# EAGLE board ArmazCape - Rev B2 (EAGLE 7.5.0)
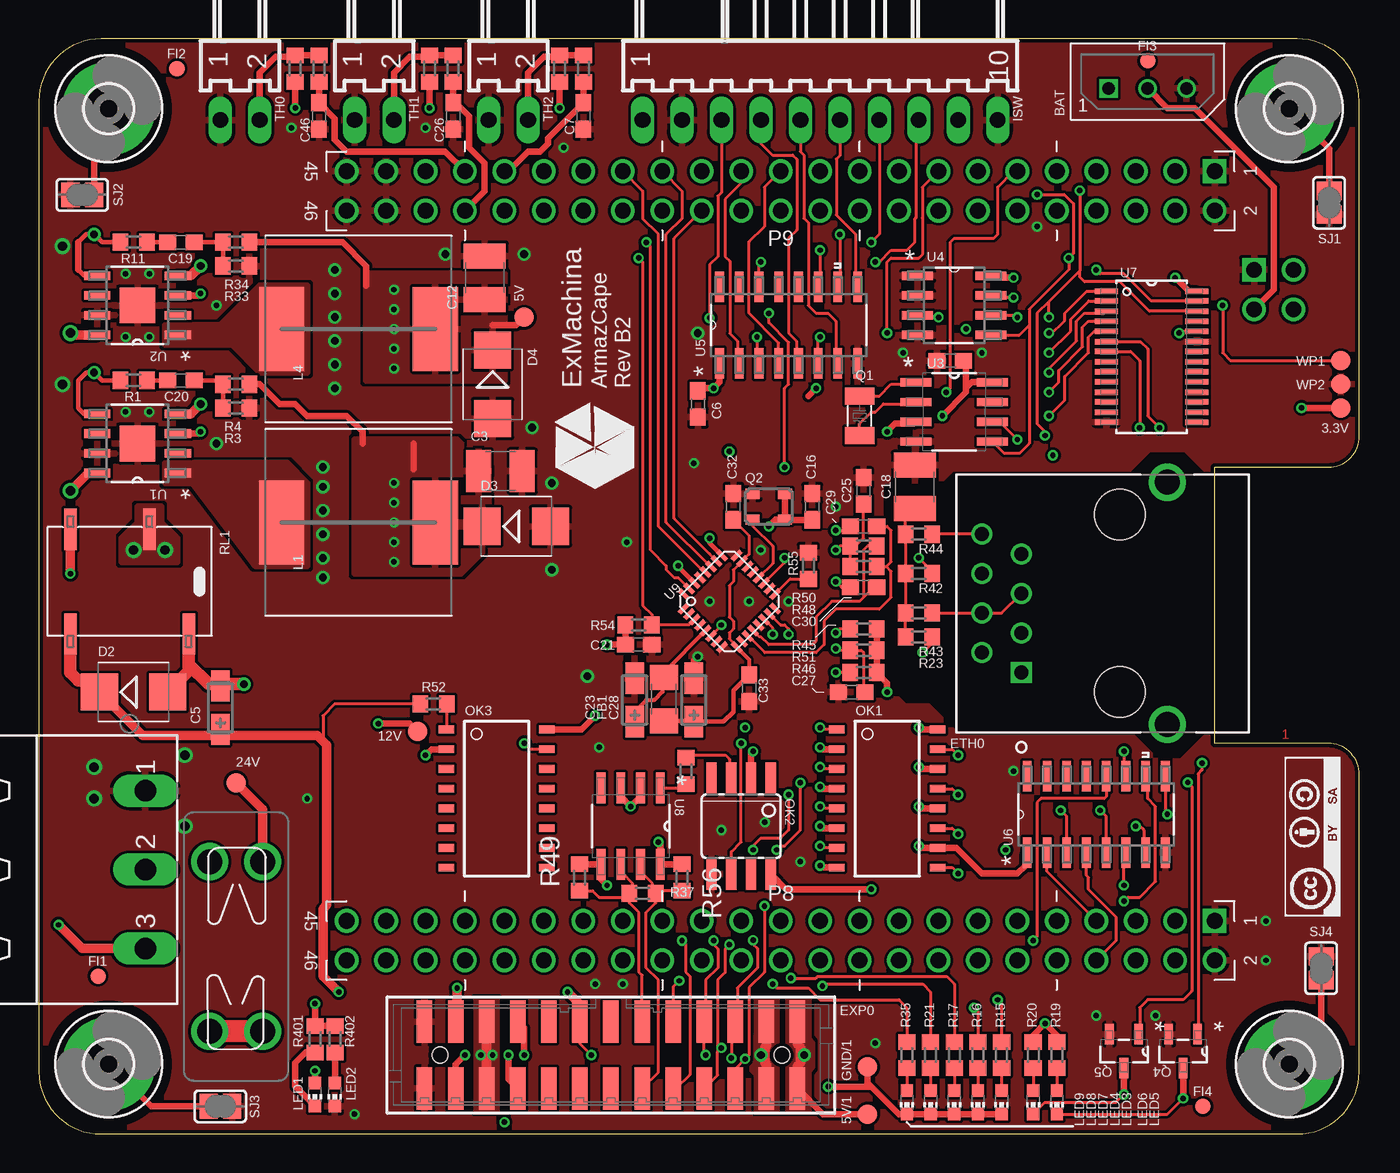
[diagram p3: board, top side]
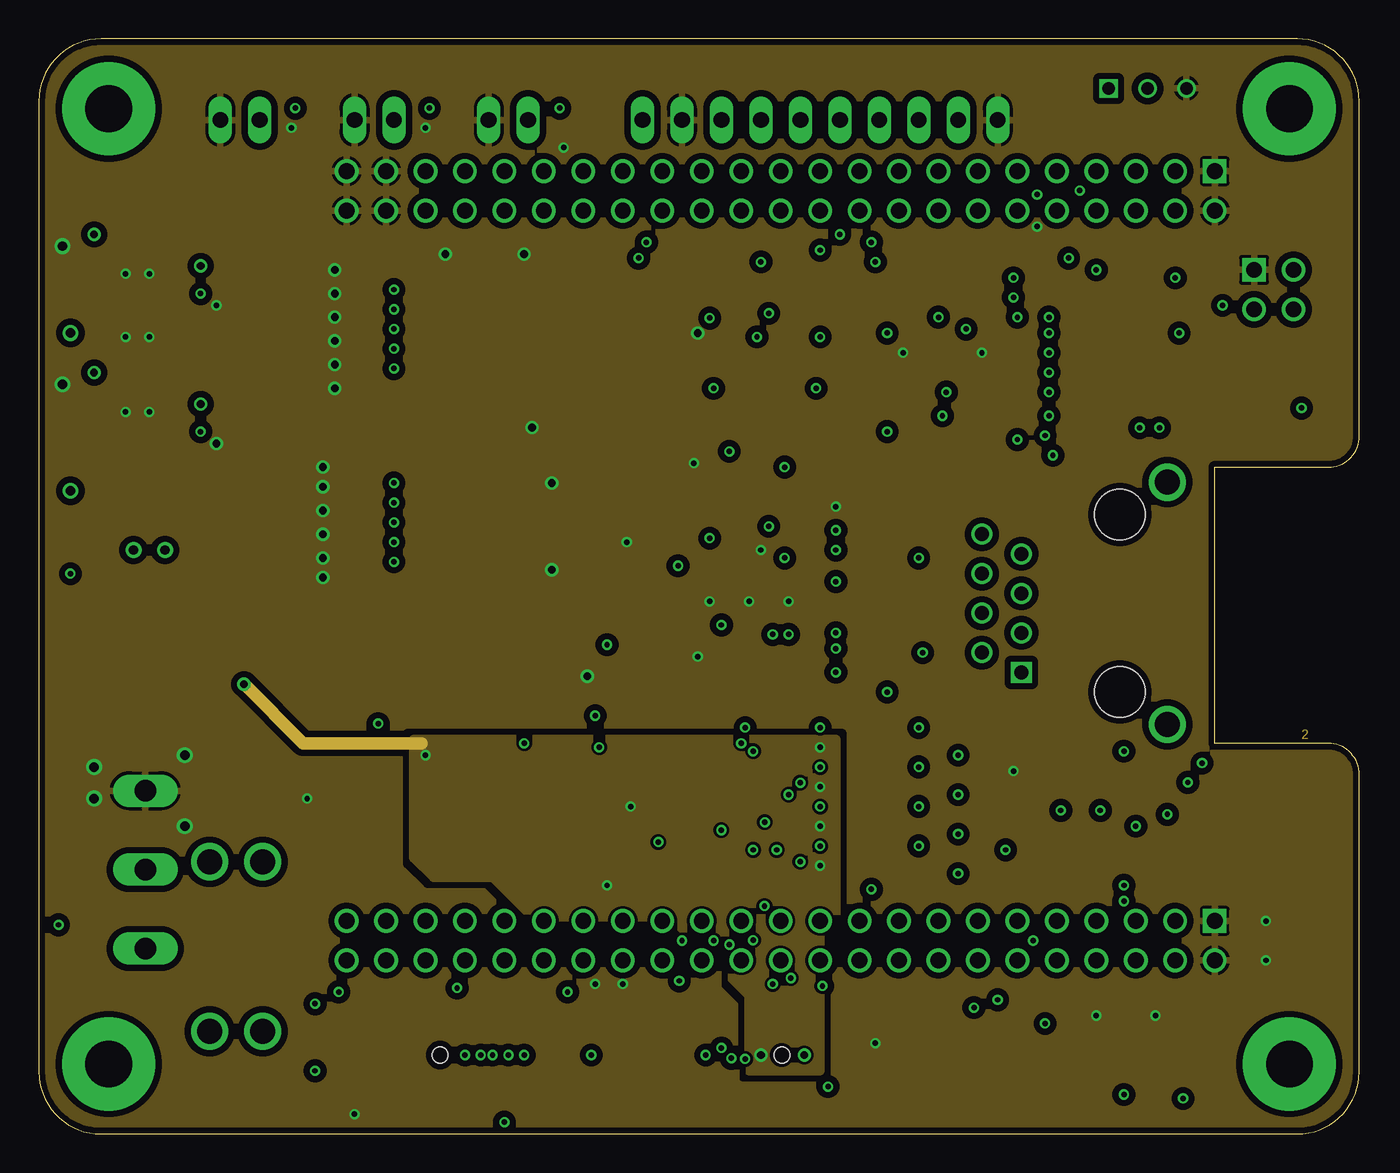
[diagram p4: board, inner layer Route2]
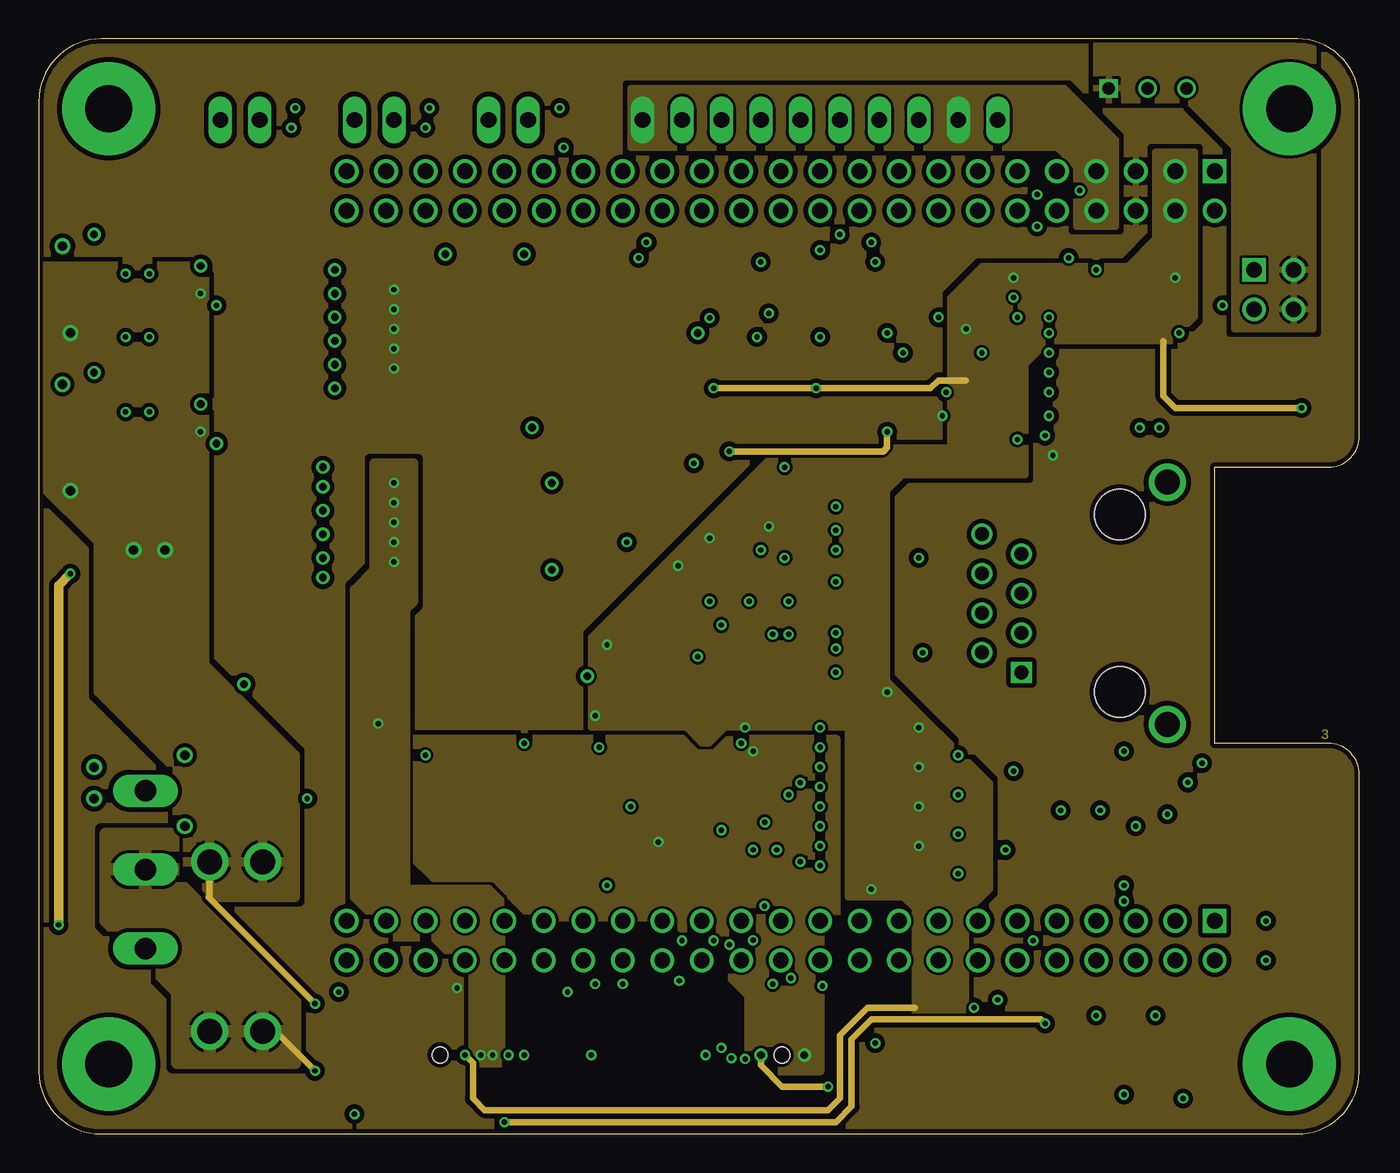
[diagram p5: board, inner layer Route15]
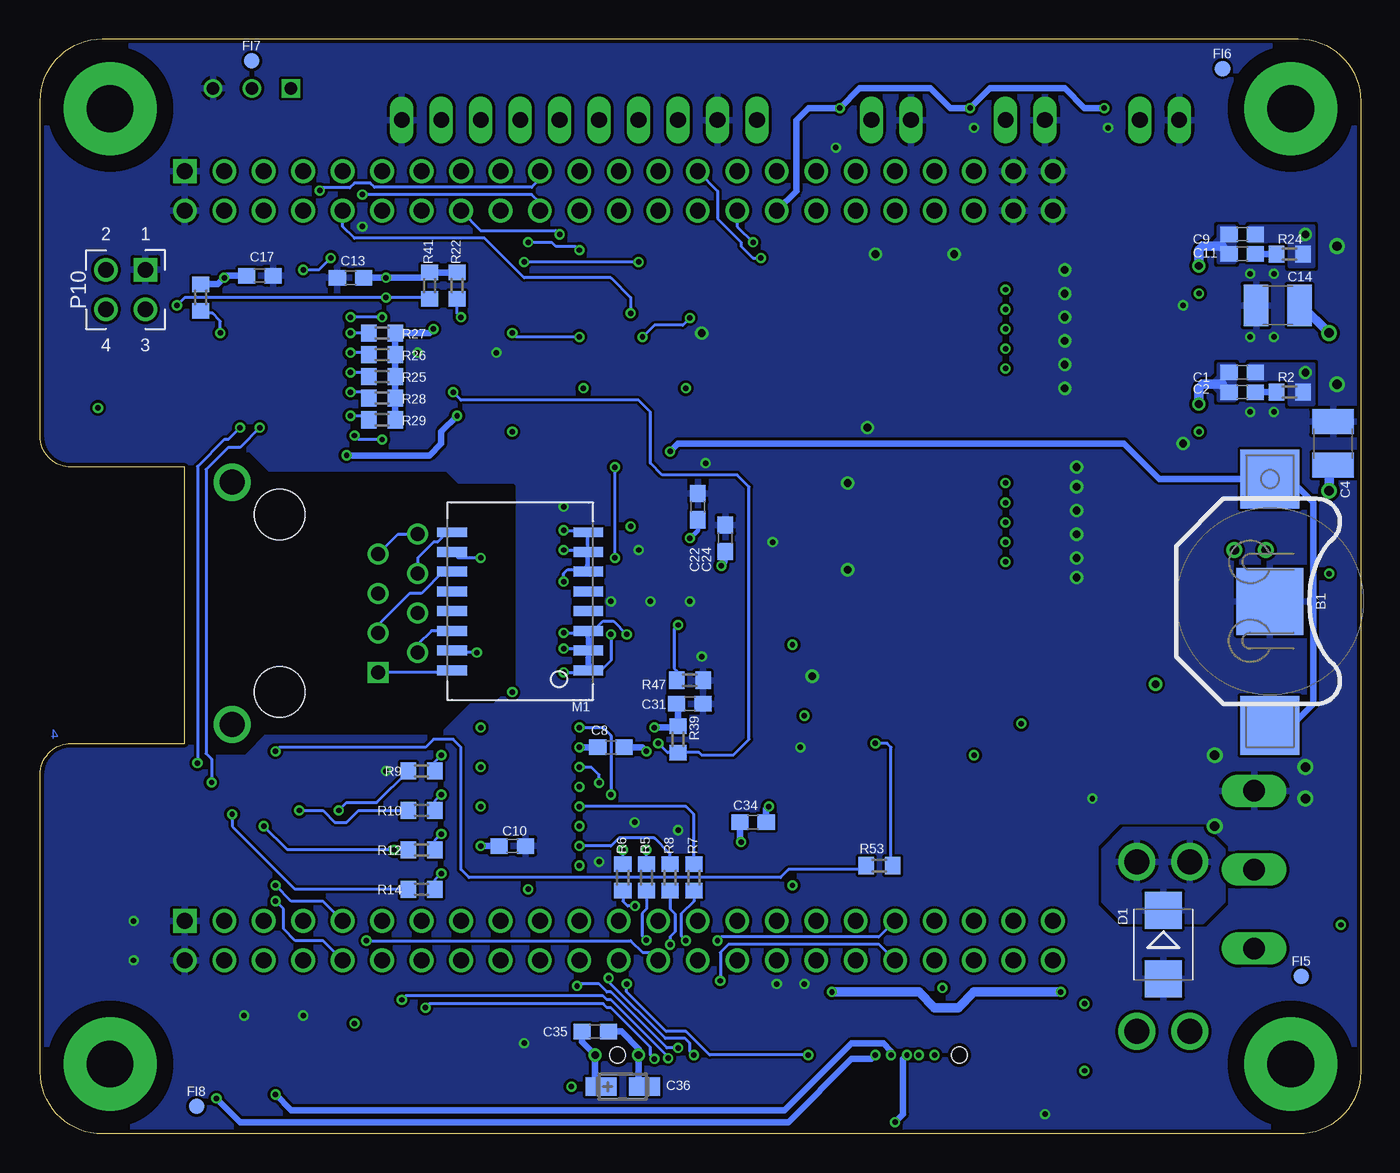
[diagram p6: board, bottom side, seen from below]

Size 85 x 70.5 mm. Coordinates in mm from the lower left corner, seen from the top.
Outline: 75.69,42.93 83,42.93 arc90 85,44.93 85,66.5 arc90 81,70.5 4,70.5 arc90 0,66.5 0,4 arc90 4,0 81,0 arc90 85,4 85,23.15 arc90 83,25.15 75.69,25.15 75.69,42.93
Copper layers (1+2*15+16): Top 0.018mm / dielectric 0.36mm / Route2 0.035mm / dielectric 0.71mm / Route15 0.035mm / dielectric 0.36mm / Bottom 0.018mm
Design rules "eC_4Layer_PClass5_BaseCopperO18-I35 *": minimum track width 0.175mm, minimum drill 0.35mm, track to track 0.175mm, track to pad 0.175mm, pad to pad 0.175mm, via to via 0.175mm, smd to smd 0mil, copper to edge 0.25mm, drill to drill 0.35mm, minimum pad ring 0.2mm, minimum via ring 0.15mm, stop-mask expansion 0mil, vias tented up to drill 0.45mm, thermal gap 0.2mm
Net classes: 0 default: width 0.178 mm, drill 0.25 mm, clearance 0.102 mm; 1 supply: width 0.406 mm, drill 0.35 mm, clearance 0.203 mm to class 0, clearance 0.02 mm

## Footprints (pad centres in the part's own frame; a part is rotated, then mirrored left to right if it is on the bottom)
B1,27 = smd 1.27 x 1.27: TP 0,0
3000 = smd 3.81 x 3.81: +1 -7.874,0; +2 8.001,0 | smd 4.318 x 4.318: - 0,0
5267-02A = drill 0.8 square: P1 -2.5,0 | drill 0.8: P2 0,0; P3 2.5,0
BBB = drill 1.016 square: P8.1 -27.94,46.99; P9.1 -27.94,-1.27; P10.1 -30.48,5.08 | drill 1.016: P8.2 -27.94,49.53; P8.3 -25.4,46.99; P8.4 -25.4,49.53; P8.5 -22.86,46.99; P8.6 -22.86,49.53; P8.7 -20.32,46.99; P8.8 -20.32,49.53; P8.9 -17.78,46.99; P8.10 -17.78,49.53; P8.11 -15.24,46.99; P8.12 -15.24,49.53; P8.13 -12.7,46.99; P8.14 -12.7,49.53; P8.15 -10.16,46.99; P8.16 -10.16,49.53; P8.17 -7.62,46.99; P8.18 -7.62,49.53; P8.19 -5.08,46.99; P8.20 -5.08,49.53; P8.21 -2.54,46.99; P8.22 -2.54,49.53; P8.23 0,46.99; P8.24 0,49.53; P8.25 2.54,46.99; P8.26 2.54,49.53; P8.27 5.08,46.99; P8.28 5.08,49.53; P8.29 7.62,46.99; P8.30 7.62,49.53; P8.31 10.16,46.99; P8.32 10.16,49.53; P8.33 12.7,46.99; P8.34 12.7,49.53; P8.35 15.24,46.99; P8.36 15.24,49.53; P8.37 17.78,46.99; P8.38 17.78,49.53; P8.39 20.32,46.99; P8.40 20.32,49.53; P8.41 22.86,46.99; P8.42 22.86,49.53; P8.43 25.4,46.99; P8.44 25.4,49.53; P8.45 27.94,46.99; P8.46 27.94,49.53; P9.2 -27.94,1.27; P9.3 -25.4,-1.27; P9.4 -25.4,1.27; P9.5 -22.86,-1.27; P9.6 -22.86,1.27; P9.7 -20.32,-1.27; P9.8 -20.32,1.27; P9.9 -17.78,-1.27; P9.10 -17.78,1.27; P9.11 -15.24,-1.27; P9.12 -15.24,1.27; P9.13 -12.7,-1.27; P9.14 -12.7,1.27; P9.15 -10.16,-1.27; P9.16 -10.16,1.27; P9.17 -7.62,-1.27; P9.18 -7.62,1.27; P9.19 -5.08,-1.27; P9.20 -5.08,1.27; P9.21 -2.54,-1.27; P9.22 -2.54,1.27; P9.23 0,-1.27; P9.24 0,1.27; P9.25 2.54,-1.27; P9.26 2.54,1.27; P9.27 5.08,-1.27; P9.28 5.08,1.27; P9.29 7.62,-1.27; P9.30 7.62,1.27; P9.31 10.16,-1.27; P9.32 10.16,1.27; P9.33 12.7,-1.27; P9.34 12.7,1.27; P9.35 15.24,-1.27; P9.36 15.24,1.27; P9.37 17.78,-1.27; P9.38 17.78,1.27; P9.39 20.32,-1.27; P9.40 20.32,1.27; P9.41 22.86,-1.27; P9.42 22.86,1.27; P9.43 25.4,-1.27; P9.44 25.4,1.27; P9.45 27.94,-1.27; P9.46 27.94,1.27; P10.2 -33.02,5.08; P10.3 -30.48,7.62; P10.4 -33.02,7.62
C0603 = smd 1.1 x 1: 1 -0.85,0; 2 0.85,0
C1210 = smd 1.6 x 2.7: 1 -1.4,0; 2 1.4,0
CT3216 = smd 2 x 1.2: + -1.4,0; - 1.4,0
SMB = smd 2.4 x 2.4: A 2.2,0; C -2.2,0
MOLEX_85505-5113 = drill 0.9 square: 1 0,0 | drill 0.9: 2 1.27,2.54; 3 2.54,0; 4 3.81,2.54; 5 5.08,0; 6 6.35,2.54; 7 7.62,0; 8 8.89,2.54 | drill 1.6: M1 -3.35,-9.4; M2 12.24,-9.4 | hole 3.25: -1.27,-6.35; 10.16,-6.35
87832-26 = smd 1 x 2.75: 1 -12,-2.15; 2 -12,2.15; 3 -10,-2.15; 4 -10,2.15; 5 -8,-2.15; 6 -8,2.15; 7 -6,-2.15; 8 -6,2.15; 9 -4,-2.15; 10 -4,2.15; 11 -2,-2.15; 12 -2,2.15; 13 0,-2.15; 14 0,2.15; 15 2,-2.15; 16 2,2.15; 17 4,-2.15; 18 4,2.15; 19 6,-2.15; 20 6,2.15; 21 8,-2.15; 22 8,2.15; 23 10,-2.15; 24 10,2.15; 25 12,-2.15; 26 12,2.15 | hole 1: -11,0; 11,0
1206 = smd 1.6 x 1.8: 1 -1.451,0.025; 2 1.349,0.025
FIDUCIAL-1X2 = smd 1 x 1: 1 0,0
3557-LITTLE = drill 1.6: 1 -5.461,-1.702; 2 -5.461,1.702; 3 5.461,-1.702; 4 5.461,1.702
P3,0 = drill 3 pad 6: 1 0,0
7395-10 = drill 1.016 long: 1 11.43,0; 2 8.89,0; 3 6.35,0; 4 3.81,0; 5 1.27,0; 6 -1.27,0; 7 -3.81,0; 8 -6.35,0; 9 -8.89,0; 10 -11.43,0
WE-PD_1260/1245/1280/1210 = smd 2.9 x 5.4: 1 -4.95,0; 2 4.95,0
CHIP-LED0603 = smd 0.8 x 0.8: A 0,-0.75; C 0,0.75
7490100 = smd 0.64 x 1.91: 1 -4.445,-4.385; 2 -3.175,-4.385; 3 -1.905,-4.385; 4 -0.635,-4.385; 5 0.635,-4.385; 6 1.905,-4.385; 7 3.175,-4.385; 8 4.445,-4.385; 9 4.445,4.385; 10 3.175,4.385; 11 1.905,4.385; 12 0.635,4.385; 13 -0.635,4.385; 14 -1.905,4.385; 15 -3.175,4.385; 16 -4.445,4.385
MINI-FLAT-16 = smd 1 x 0.5: 1 -3.24,4.445; 2 -3.24,3.175; 3 -3.24,1.905; 4 -3.24,0.635; 5 -3.24,-0.635; 6 -3.24,-1.905; 7 -3.24,-3.175; 8 -3.24,-4.445; 9 3.24,-4.445; 10 3.24,-3.175; 11 3.24,-1.905; 12 3.24,-0.635; 13 3.24,0.635; 14 3.24,1.905; 15 3.24,3.175; 16 3.24,4.445
SOIC08 = smd 0.66 x 2.032: 1 -1.905,-3.073; 2 -0.635,-3.073; 3 0.635,-3.073; 4 1.905,-3.073; 5 1.905,3.073; 6 0.635,3.073; 7 -0.635,3.073; 8 -1.905,3.073
MSTBA3 = drill 1.397 long: 1 -5.08,5.08; 2 0,5.08; 3 5.08,5.08
ABS07 = smd 1.092 x 1.905: 1 -1.27,0; 2 1.27,0
ASE = smd 0.9 x 0.65: 1 -1.05,-0.825; 2 1.05,-0.825; 3 1.05,0.825; 4 -1.05,0.825
SOT95P240X112-3N = smd 1.321 x 0.559: 1 -1.092,0.94; 2 -1.092,-0.94; 3 1.092,0
R0603 = smd 1 x 1.1: 1 -0.85,0; 2 0.85,0
G6L-1F = smd 0.8 x 2.66: 2 -1.27,-3.37; 4 3.81,-3.37; 5 3.81,3.37; 8 -3.81,3.37
SJ = smd 1.168 x 1.6: 1 -0.762,0; 2 0.762,0
7395-02 = drill 1.016 long: 1 1.27,0; 2 -1.27,0
SOIC127P600X170-9N = smd 1.702 x 0.559: 1 -2.591,1.905; 2 -2.591,0.635; 3 -2.591,-0.635; 4 -2.591,-1.905; 5 2.591,-1.905; 6 2.591,-0.635; 7 2.591,0.635; 8 2.591,1.905 | smd 2.311 x 2.311: 9 0,0
MAXIM_SOIC127P600X175-8N = smd 1.981 x 0.533: 1 -2.464,1.905; 2 -2.464,0.635; 3 -2.464,-0.635; 4 -2.464,-1.905; 5 2.464,-1.905; 6 2.464,-0.635; 7 2.464,0.635; 8 2.464,1.905
MICROCHIP_BY_ELEMENT14_BATCH_1_SOIC127P600X175-8N = smd 1.981 x 0.559: 1 -2.362,1.905; 2 -2.362,0.635; 3 -2.362,-0.635; 4 -2.362,-1.905; 5 2.362,-1.905; 6 2.362,-0.635; 7 2.362,0.635; 8 2.362,1.905
SOIC127P600X175-16N = smd 1.981 x 0.559: 1 -2.464,4.445; 2 -2.464,3.175; 3 -2.464,1.905; 4 -2.464,0.635; 5 -2.464,-0.635; 6 -2.464,-1.905; 7 -2.464,-3.175; 8 -2.464,-4.445; 9 2.464,-4.445; 10 2.464,-3.175; 11 2.464,-1.905; 12 2.464,-0.635; 13 2.464,0.635; 14 2.464,1.905; 15 2.464,3.175; 16 2.464,4.445
SOP65P640X110-28N = smd 1.473 x 0.356: 1 -2.921,4.216; 2 -2.921,3.581; 3 -2.921,2.921; 4 -2.921,2.286; 5 -2.921,1.626; 6 -2.921,0.965; 7 -2.921,0.33; 8 -2.921,-0.33; 9 -2.921,-0.965; 10 -2.921,-1.626; 11 -2.921,-2.286; 12 -2.921,-2.921; 13 -2.921,-3.581; 14 -2.921,-4.216; 15 2.921,-4.216; 16 2.921,-3.581; 17 2.921,-2.921; 18 2.921,-2.286; 19 2.921,-1.626; 20 2.921,-0.965; 21 2.921,-0.33; 22 2.921,0.33; 23 2.921,0.965; 24 2.921,1.626; 25 2.921,2.286; 26 2.921,2.921; 27 2.921,3.581; 28 2.921,4.216
SOIC127P600X175-8N = smd 1.981 x 0.559: 1 -2.464,1.905; 2 -2.464,0.635; 3 -2.464,-0.635; 4 -2.464,-1.905; 5 2.464,-1.905; 6 2.464,-0.635; 7 2.464,0.635; 8 2.464,1.905
QFN50P500X500X85-32L = smd 0.8 x 0.3: 1 -2.41,1.75; 2 -2.41,1.25; 3 -2.41,0.75; 4 -2.41,0.25; 5 -2.41,-0.25; 6 -2.41,-0.75; 7 -2.41,-1.25; 8 -2.41,-1.75; 17 2.41,-1.75; 18 2.41,-1.25; 19 2.41,-0.75; 20 2.41,-0.25; 21 2.41,0.25; 22 2.41,0.75; 23 2.41,1.25; 24 2.41,1.75 | smd 0.3 x 0.8: 9 -1.75,-2.41; 10 -1.25,-2.41; 11 -0.75,-2.41; 12 -0.25,-2.41; 13 0.25,-2.41; 14 0.75,-2.41; 15 1.25,-2.41; 16 1.75,-2.41; 25 1.75,2.41; 26 1.25,2.41; 27 0.75,2.41; 28 0.25,2.41; 29 -0.25,2.41; 30 -0.75,2.41; 31 -1.25,2.41; 32 -1.75,2.41

## Placement (x,y rotation side)
3.3V  TPB1,27  [B1,27]  83.82,46.74 180 top
5V  TPB1,27  [B1,27]  31.24,52.58 0 top
5V/1  TPB1,27  [B1,27]  53.34,1.27 180 top
12V  TPB1,27  [B1,27]  24.38,25.91 0 top
24V  TPB1,27  [B1,27]  12.7,22.61 270 top
B1  3000  [3000]  5.84,34.29 270 bottom
BAT  22-03-50  [5267-02A]  71.37,67.31 0 top
BB1  BBB  [BBB]  47.75,60.71 180 top
C1  470pF  [C0603]  7.62,49.02 0 bottom
C2  22nF  [C0603]  7.62,47.75 0 bottom
C3  47uF, 16V  [C1210]  29.72,42.67 0 top
C4  4.7uF, 50V  [C1210]  1.78,44.45 90 bottom
C5  4.7uF  [CT3216]  11.68,27.43 90 top
C6  0.1uF  [C0603]  42.42,46.99 270 top
C7  4.7uF  [C0603]  35.05,65.53 270 top
C8  0.1uF  [C0603]  48.26,24.89 180 bottom
C9  330pF  [C0603]  7.62,57.91 0 bottom
C10  0.1uF  [C0603]  54.61,18.54 0 bottom
C11  22nF  [C0603]  7.62,56.64 0 bottom
C12  47uF, 16V  [C1210]  28.7,55.12 90 top
C13  0.1uF  [C0603]  65.02,55.12 180 bottom
C14  4.7uF, 50V  [C1210]  5.33,53.34 180 bottom
C15  0.1uF  [C0603]  58.67,49.78 180 top
C16  0.1uF  [C0603]  49.78,40.39 90 top
C17  0.1uF  [C0603]  70.87,55.24 0 bottom
C18  1000pF, 2kV  [C1210]  56.39,41.66 90 top
C19  5.6nF  [C0603]  9.14,57.4 180 top
C20  4.7nF  [C0603]  9.14,48.51 180 top
C21  0.1uF  [C0603]  38.61,31.5 0 top
C22  0.1uF  [C0603]  42.67,40.39 90 bottom
C23  4.7uF  [CT3216]  38.35,27.94 90 top
C24  0.1uF  [C0603]  40.89,38.35 90 bottom
C25  0.01uF  [C0603]  53.09,41.4 90 top
C26  4.7uF  [C0603]  26.67,65.53 270 top
C27  0.01uF  [C0603]  52.32,28.45 180 top
C28  4.7uF  [CT3216]  42.16,27.94 90 top
C29  6.8nF  [C0603]  53.09,39.12 180 top
C30  6.8nF  [C0603]  53.09,35.2 180 top
C31  0.1uF  [C0603]  43.18,27.69 0 bottom
C32  0.1uF  [C0603]  44.7,40.39 90 top
C33  0.1uF  [C0603]  45.72,28.7 270 top
C34  0.1uF  [C0603]  39.12,20.07 0 bottom
C35  0.1uF  [C0603]  49.28,6.6 0 bottom
C36  4.7uF  [CT3216]  47.5,3.05 0 bottom
C46  4.7uF  [C0603]  18.03,65.53 270 top
D1  STPS3L40UF  [SMB]  12.7,12.19 270 bottom
D2  STPS3L40UF  [SMB]  6.1,28.45 0 top
D3  STPS3L40UF  [SMB]  30.73,39.12 0 top
D4  STPS3L40UF  [SMB]  29.21,48.26 270 top
ETH0  85505-5113  [MOLEX_85505-5113]  63.25,29.72 90 top
EXP0  87832-26  [87832-26]  36.83,5.08 180 top
FB1  HI1206N101R-10  [1206]  40.21,27.94 270 top
FI1  FIDUCIAL1X2  [FIDUCIAL-1X2]  3.81,10.16 0 top
FI2  FIDUCIAL1X2  [FIDUCIAL-1X2]  8.89,68.58 0 top
FI3  FIDUCIAL1X2  [FIDUCIAL-1X2]  71.37,69.09 0 top
FI4  FIDUCIAL1X2  [FIDUCIAL-1X2]  74.93,1.78 0 top
FI5  FIDUCIAL1X2  [FIDUCIAL-1X2]  3.81,10.16 0 bottom
FI6  FIDUCIAL1X2  [FIDUCIAL-1X2]  8.89,68.58 0 bottom
FI7  FIDUCIAL1X2  [FIDUCIAL-1X2]  71.37,69.09 0 bottom
FI8  FIDUCIAL1X2  [FIDUCIAL-1X2]  74.93,1.78 0 bottom
FU1  FUSE3557L  [3557-LITTLE]  12.7,12.06 90 top
GND/1  TPB1,27  [B1,27]  53.34,4.32 0 top
H1  MOUNT-PAD3,0  [P3,0]  80.5,4.5 180 top
H2  MOUNT-PAD3,0  [P3,0]  4.5,4.5 180 top
H3  MOUNT-PAD3,0  [P3,0]  4.5,66 180 top
H4  MOUNT-PAD3,0  [P3,0]  80.5,66 180 top
ISW  22-05-7108-10  [7395-10]  50.29,65.28 180 top
L1  47uH  [WE-PD_1260/1245/1280/1210]  20.57,39.37 0 top
L4  33uH  [WE-PD_1260/1245/1280/1210]  20.57,51.82 0 top
LED1  red  [CHIP-LED0603]  17.78,2.54 180 top
LED2  blue  [CHIP-LED0603]  19.05,2.54 180 top
LED3  blue  [CHIP-LED0603]  61.98,2.03 180 top
LED4  blue  [CHIP-LED0603]  60.45,2.03 180 top
LED5  blue  [CHIP-LED0603]  65.53,2.03 180 top
LED6  blue  [CHIP-LED0603]  64.01,2.03 180 top
LED7  blue  [CHIP-LED0603]  58.93,2.03 180 top
LED8  blue  [CHIP-LED0603]  57.4,2.03 180 top
LED9  blue  [CHIP-LED0603]  55.88,2.03 180 top
M1  7490100111A  [7490100]  54.1,34.29 90 bottom
OK1  TLP283-4  [MINI-FLAT-16]  54.61,21.59 0 top
OK2  HCPL0601  [SOIC08]  45.21,19.81 180 top
OK3  TLP283-4  [MINI-FLAT-16]  29.46,21.59 0 top
POW  MSTBA3  [MSTBA3]  1.78,17.02 270 top
Q1  32.768kHz, 12.5pF  [ABS07]  52.83,46.23 270 top
Q2  ASE  [ASE]  46.99,40.39 180 top
Q4  IRLML6344TRPBF  [SOT95P240X112-3N]  73.66,5.33 270 top
Q5  IRLML6344TRPBF  [SOT95P240X112-3N]  69.85,5.33 270 top
R1  200  [R0603]  6.1,48.51 180 top
R2  2K2  [R0603]  4.57,47.75 0 bottom
R3  270  [R0603]  12.7,46.74 180 top
R4  5K1  [R0603]  12.7,48.26 0 top
R5  100  [R0603]  45.97,16.51 270 bottom
R6  100  [R0603]  47.5,16.51 270 bottom
R7  100  [R0603]  42.93,16.51 270 bottom
R8  100  [R0603]  44.45,16.51 270 bottom
R9  1k  [R0603]  60.45,23.37 180 bottom
R10  1k  [R0603]  60.45,20.83 0 bottom
R11  160  [R0603]  6.1,57.4 180 top
R12  1k  [R0603]  60.45,18.29 0 bottom
R13  4K7, 1%  [R0603]  25.15,68.58 270 top
R14  1k  [R0603]  60.45,15.75 0 bottom
R15  1.5K  [R0603]  61.98,5.08 90 top
R16  1.5K  [R0603]  60.45,5.08 90 top
R17  1.5K  [R0603]  58.93,5.08 90 top
R18  4K7, 1%  [R0603]  16.51,68.58 270 top
R19  4.7K  [R0603]  65.53,5.08 90 top
R20  4.7K  [R0603]  64.01,5.08 90 top
R21  1.5K  [R0603]  57.4,5.08 90 top
R22  4.7K  [R0603]  58.17,54.61 90 bottom
R23  75  [R0603]  56.64,32 0 top
R24  3K6  [R0603]  4.57,56.64 0 bottom
R25  4.7K  [R0603]  62.99,48.77 0 bottom
R26  4.7K  [R0603]  62.99,50.16 0 bottom
R27  4.7K  [R0603]  62.99,51.56 0 bottom
R28  4.7K  [R0603]  62.99,47.37 0 bottom
R29  4.7K  [R0603]  62.99,45.97 0 bottom
R30  4.7K  [R0603]  74.68,53.85 90 bottom
R31  4K7, 1%  [R0603]  33.53,68.58 270 top
R32  10K  [R0603]  35.05,68.58 270 top
R33  698  [R0603]  12.7,55.88 180 top
R34  5K1  [R0603]  12.7,57.4 0 top
R35  1K5  [R0603]  55.88,5.08 90 top
R36  470  [R0603]  41.66,23.37 90 top
R37  120, DNI  [R0603]  38.86,15.49 0 top
R38  10K  [R0603]  26.67,68.58 270 top
R39  3K3  [R0603]  43.94,25.4 270 bottom
R40  10K  [R0603]  18.03,68.58 270 top
R41  4.7K  [R0603]  59.94,54.61 90 bottom
R42  75  [R0603]  56.64,36.07 0 top
R43  75  [R0603]  56.64,33.53 0 top
R44  75  [R0603]  56.64,38.61 0 top
R45  49.9  [R0603]  53.09,32.51 180 top
R46  49.9  [R0603]  53.09,29.72 0 top
R47  4.7K  [R0603]  43.18,29.21 180 bottom
R48  49.9  [R0603]  53.09,36.53 0 top
R49  1k  [R0603]  34.8,16.51 90 top
R50  49.9  [R0603]  53.09,37.85 0 top
R51  10  [R0603]  53.09,31.14 180 top
R52  100  [R0603]  25.4,27.69 180 top
R53  1k  [R0603]  30.99,17.27 0 bottom
R54  4.7K  [R0603]  38.61,32.77 180 top
R55  3K01  [R0603]  49.53,36.58 90 top
R56  1k  [R0603]  41.4,16.51 270 top
R401  4.7K  [R0603]  17.78,6.1 270 top
R402  4.7K  [R0603]  19.08,6.1 90 top
RL1  G6L5VDC  [G6L-1F]  5.84,35.56 180 top
SJ1  [SJ]  83.06,59.94 270 top
SJ2  [SJ]  2.79,60.45 180 top
SJ3  [SJ]  11.68,1.78 0 top
SJ4  [SJ]  82.55,10.67 90 top
TH0  22-05-7028-02  [7395-02]  12.95,65.28 180 top
TH1  22-05-7028-02  [7395-02]  21.59,65.28 180 top
TH2  22-05-7028-02  [7395-02]  30.23,65.28 180 top
U1  L7985A  [SOIC127P600X170-9N]  6.35,44.45 180 top
U2  L7985A  [SOIC127P600X170-9N]  6.35,53.34 180 top
U3  DS1307ZN+  [MAXIM_SOIC127P600X175-8N]  58.93,46.48 0 top
U4  24AA256-I/SN  [MICROCHIP_BY_ELEMENT14_BATCH_1_SOIC127P600X175-8N]  58.93,53.34 0 top
U5  CD4050BD  [SOIC127P600X175-16N]  48.26,52.07 90 top
U6  CD4050BD  [SOIC127P600X175-16N]  68.07,20.57 90 top
U7  PCA9685PW  [SOP65P640X110-28N]  71.63,50.04 0 top
U8  SN65HVD08D  [SOIC127P600X175-8N]  38.1,19.81 270 top
U9  KSZ8851SNLI  [QFN50P500X500X85-32L]  44.45,34.29 45 top
U$1  EXMACHINA-LOGO-NAME  [EXM-LOGO-BASELINE]  35.81,44.2 90 top
U$2  CC-BY-SA  [CC-BY-SA]  81.53,19.3 90 top
U$3  [A4L-LOC]  -83.31,-55.63 0 top  (outside the outline)
WP1  TPB1,27  [B1,27]  83.82,49.78 180 top
WP2  TPB1,27  [B1,27]  83.82,48.26 180 top

## Tracks (layer width: path | path; a pad name or v marks a point on that pad's centre or on a via)
+3V3  (via drill 0.35)
  Top 0.305: v41.15,36.58 41.15,36.53 U9.30 | v43.18,38.35 43.18,38.03 U9.25
  Top 0.406: EXP0.24 26.83,4.48 v27.43,5.08 | U4.8 61.42,55.12 v62.74,55.12 | v56.64,18.54 56.77,18.41 OK1.10 59.05,18.41 60.71,16.76 62.99,16.76 63.5,17.27 63.5,17.98 U6.1 | OK1.12 56.77,20.95 v56.64,21.08 | OK1.14 56.77,23.5 v56.64,23.62 | OK1.16 56.77,26.04 v56.64,26.16 | OK2.8 48.11,15.75 v53.59,15.75 | U5.1 43.81,48.39 v43.43,48.01 42.85,48.01 42.69,47.84 C6.1 | 3.3V.TP v81.28,46.74 | U7.28 74.02,54.25 v73.15,55.12 | 49.53,47.5 v50.04,48.01 | OK3.16 34.92,26.04 v35.81,26.92 | v54.61,28.45 54.61,29.04 R46.2 R51.1 R45.1 | R54.2 C21.1 v36.58,31.5 | Q2.4 Q2.1 | C16.1 48.06,39.54 Q2.4 | Q2.4 47.44,39.56 v46.99,39.12
  Route15 0.406: v27.43,5.08 27.94,4.57 27.94,2.29 28.7,1.52 50.8,1.52 51.56,2.29 51.56,6.35 53.34,8.13 56.39,8.13 | v43.43,48.01 v50.04,48.01 57.4,48.01 57.91,48.51 59.69,48.51 | v81.28,46.74 73.15,46.74 72.39,47.5 72.39,51.05
  Bottom 0.305: C24.1 40.89,36.83 v41.15,36.58 | C22.1 42.67,38.86 v43.18,38.35
  Bottom 0.406: C13.1 v62.74,55.12 60.29,55.12 R41.2 R22.2 | C17.1 73.03,55.24 v73.15,55.12 73.57,54.7 R30.2 | R29.2 R28.2 R25.2 R26.2 R27.2 59.94,51.56 v59.69,51.82 | v45.47,26.16 44.03,26.16 R39.1 43.94,27.6 C31.1 | C10.1 v56.64,18.54
  pour Route15 (no thermals): 74.42,63.25 71.88,63.25 71.88,57.66 70.1,55.88 60.71,55.88 58.67,53.85 58.67,44.2 47.75,44.2 35.56,32 35.56,26.16 41.66,26.16 42.67,25.15 43.18,25.15 44.2,26.16 52.07,26.16 52.07,15.24 55.63,15.24 56.39,14.48 56.39,7.62 59.69,7.62 59.69,14.22 61.21,15.75 61.21,22.61 54.61,29.21 54.61,41.4 55.63,42.42 63.5,42.42 63.5,49.53 65.02,51.05 72.9,51.05 74.42,52.58
+5V  (via drill 0.35)
  Top 0.406: R34.2 19.56,57.4 21.08,55.88 21.08,54.61 | v58.17,46.23 59.69,47.75 59.69,48.01 | 5V.TP 30.73,52.07 29.21,52.07 | 59.69,48.01 59.69,49.62 C15.1 | U3.8 60.07,48.39 59.69,48.01
  Top 0.61: EXP0.23 26.92,7.32 v26.92,9.4
  Bottom 0.406: v58.17,46.23 59.18,45.21 59.18,44.45 59.94,43.69 v65.28,43.69
  other vias: 22.86,50.55 22.86,53.09 22.86,51.82 22.86,54.36 22.86,49.28
  pour Top: 21.08,55.37 29.97,55.37 29.97,48.51 21.08,48.51
  pour Route15 (isolate 0.305, rank 5): -1.27,72.39 86.06,72.39 86.06,-1.27 -1.27,-1.27
+5V/1  (via drill 0.35, 0.5)
  Top 0.406: EXP0.2 50.49,1.27 5V/1.TP | OK2.2 45.85,24.51 v45.97,24.64 | v39.88,18.8 40.01,18.67 U8.8 R56.1
  Top 0.61: EXP0.2 48.83,4.38 49.02,4.57 49.02,5.59 48.83,5.78 EXP0.1
  Bottom 0.406: C8.1 46.23,24.89 v45.97,24.64 | C35.1 50.13,5.93 v49.28,5.08 49.28,3.43 C36.+ | C34.1 39.97,18.88 v39.88,18.8
  pour Route15 (rank 2, no thermals): 24.13,25.4 24.13,17.78 25.4,16.51 29.21,16.51 31.75,13.97 40.64,13.97 45.72,8.89 45.72,4.06 50.29,4.06 50.29,12.95 51.31,13.97 51.31,25.4
  pour Top (no thermals): 48.26,8.64 48.26,1.52 49.53,1.52 49.53,4.06 49.78,4.32 49.78,5.84 49.53,6.1 49.53,8.64
+12V  (via drill 0.35)
  Top 0.406: 20.83,44.45 20.83,45.21 19.81,46.23 17.27,46.23 16.51,46.99 15.49,46.99 14.22,48.26 R4.2 | 24.13,44.45 24.13,42.8 | R20.2 64.01,6.35 v64.77,7.11 65.53,6.35 R19.2 | 12V.TP 23.88,26.42 v21.84,26.42
  Top 0.61: EXP0.21 EXP0.22
  Route15 0.406: v29.97,0.76 51.31,0.76 52.32,1.78 52.32,6.1 53.59,7.37 64.52,7.37 v64.77,7.11
  Bottom 0.406: v29.97,0.76 29.46,1.27 29.46,4.83 v29.21,5.08
  other vias: 22.86,39.37 22.86,41.91 22.86,40.64 22.86,38.1 28.45,5.08 22.86,36.83
  pour Top: 20.32,44.7 26.92,44.7 27.69,43.94 28.96,43.94 28.96,37.85 27.18,36.07 20.32,36.07
  pour Route15 (no thermals): 21.59,43.18 21.59,36.32 20.32,35.05 20.32,15.24 22.86,12.7 25.4,12.7 27.94,10.16 27.94,4.57 29.72,4.57 29.72,14.99 28.96,15.75 23.62,15.75 23.62,33.78 24.13,34.29 24.13,43.18
  pour Top (no thermals): 28.19,1.52 29.46,1.52 29.46,8.64 28.19,8.64
BAT
  pour Route15: 82.04,51.82 82.04,72.39 68.07,72.39 68.07,66.55 73.91,66.55 76.96,63.5 76.96,51.82
BAT_TEMP
  Top 0.406: BB1.P10.3 79.5,54.36 79.5,60.96 74.42,66.04 72.64,66.04 BAT.P2
DMX0-A
  Top 0.178: EXP0.11 38.83,10.22 38.63,10.41 38.63,14.25 38.01,14.87 R37.1 | R37.1 38.23,15.71 38.23,16.13 37.59,16.76 37.59,17.22 U8.6 | R49.1 35.65,15.66 36.07,15.24 37.76,15.24 R37.1
DMX0-B
  Top 0.178: EXP0.12 39.88,3.98 39.88,9.91 39.09,10.69 39.09,14.25 39.71,14.87 R37.2 | R37.2 39.5,15.71 39.5,16.13 38.86,16.76 38.86,17.22 U8.7 | R56.2 39.88,15.66 R37.2
DRVEN_OUT  (via drill 0.35)
  Top 0.61: POW.3 2.79,11.94 v1.27,13.46 | v2.03,36.07 RL1.4
  Route15 0.61: v1.27,13.46 1.27,35.31 v2.03,36.07
DV0  (via drill 0.35)
  Top 0.178: 34.8,8.38 34.8,7.26 EXP0.15 34.83,5.81 v35.56,5.08 | v47.24,9.65 47.5,9.4 49.53,9.4 50.29,8.64 55.37,8.64 55.88,8.13 R35.2 | R52.2 19.05,27.69 18.29,26.92 18.29,25.3 18.54,25.04 | C5.+ 11.68,25.91 11.43,25.65
  Top 0.61: 34.8,8.38 v34.04,9.14 | v19.3,9.14 18.29,10.16 18.29,14.48 18.54,14.73 18.54,25.04 17.93,25.65 11.43,25.65 6.69,25.65 D2.C
  Top 0.813: RL1.5 2.03,29.72 2.54,29.21 3.13,29.21 D2.C
  Bottom 0.178: v35.56,5.08 41.91,5.08 43.43,6.6 44.7,6.6 47.24,9.14 v47.24,9.65
  Bottom 0.61: v34.04,9.14 28.45,9.14 27.43,8.13 25.91,8.13 24.89,9.14 v19.3,9.14
ESW0  (via drill 0.35)
  Top 0.178: v45.97,12.47 45.97,12.22 46.25,11.94 46.25,10.69 44.96,9.4 44.96,7.36 EXP0.5 44.58,6.98 v44.58,4.88 | v61.72,8.64 61.98,8.38 R15.2
  Bottom 0.178: R5.2 45.97,14.48 46.25,14.2 46.25,12.75 v45.97,12.47 | v44.58,4.88 44.58,4.95 48.26,8.64 48.51,8.64 48.77,8.89 61.47,8.89 v61.72,8.64
ESW1  (via drill 0.35)
  Top 0.178: v46.71,14.68 46.71,10.41 45.72,9.42 45.72,5.08 v45.47,4.83 44.83,4.19 EXP0.6 | v60.2,8.13 60.45,7.87 R16.2
  Bottom 0.178: R6.2 47.5,14.99 47.19,14.68 v46.71,14.68 | v45.47,4.83 45.72,5.08 45.72,5.59 48.26,8.13 48.51,8.13 48.77,8.38 59.94,8.38 v60.2,8.13
ESW2  (via drill 0.35)
  Top 0.178: v43.43,12.45 43.43,12.19 43.71,11.91 43.71,10.69 42.93,9.91 42.93,7.33 EXP0.7 42.83,5.18 v42.93,5.08 | v48.41,10.03 50.01,10.03 50.11,10.13 58.45,10.13 58.93,9.65 R17.2
  Bottom 0.178: 43.74,14.17 43.74,12.75 v43.43,12.45 | v42.93,5.08 43.18,5.33 43.18,5.84 43.48,6.15 44.76,6.15 48.41,9.8 v48.41,10.03
  Bottom 0.2: R7.2 42.93,14.99 43.74,14.17
ESW3  (via drill 0.35)
  Top 0.178: v44.45,12.19 44.17,11.91 44.17,10.39 43.69,9.91 43.69,5.28 | EXP0.8 43.69,3.79 43.69,5.28 | 43.69,5.28 v43.94,5.54 | v50.44,9.53 50.57,9.65 56.9,9.65 57.4,9.14 R21.2
  Bottom 0.178: 44.15,14.17 44.15,13.01 44.45,12.7 v44.45,12.19 | v43.94,5.54 44.65,5.54 48.26,9.14 48.51,9.14 49.02,9.65 50.32,9.65 v50.44,9.53
  Bottom 0.2: R8.2 44.45,14.48 44.15,14.17
FAN0  (via drill 0.35)
  Top 0.178: U7.6 70.92,51 71.37,50.55 71.37,46.23 v72.14,45.47 | v74.88,23.88 74.88,23.42 74.62,23.16 74.62,6.45 Q4.1
  Bottom 0.178: v72.14,45.47 72.9,44.7 73.15,44.7 74.88,42.98 v74.88,23.88
FAN0_GND  (via drill 0.35)
  Top 0.178: LED5.C 72.66,1.28 v73.66,2.29
  Top 0.406: v73.66,2.29 Q4.3 | EXP0.19 31.24,6.82 v31.24,5.08
  Bottom 0.406: v31.24,5.08 31.5,4.83 32.77,4.83 36.83,0.76 72.14,0.76 v73.66,2.29
FAN1  (via drill 0.35)
  Top 0.178: U7.7 70.28,50.37 70.87,49.78 v70.87,45.47 | v73.97,22.63 74.22,22.38 74.22,9.2 73.66,8.64 71.37,8.64 70.87,8.13 70.87,6.5 Q5.1
  Bottom 0.178: v70.87,45.47 72.14,44.2 72.9,44.2 74.32,42.77 74.32,24.49 73.97,24.13 v73.97,22.63
FAN1_GND  (via drill 0.35)
  Top 0.178: LED6.C 64.76,2.03 69.34,2.03 v69.85,2.54
  Top 0.406: EXP0.20 30.23,3.53 v30.23,5.08 | v69.85,2.54 Q5.3
  Bottom 0.406: v30.23,5.08 30.23,5.33 30.73,5.84 32.77,5.84 37.08,1.52 68.83,1.52 v69.85,2.54
GND  (via drill 0.35, 0.5, 0.6)
  Top 0.406: C28.- 42.16,30.48 v42.42,30.73
  other vias: 5.59,55.37 7.11,55.37 5.59,51.31 7.11,51.31 20.32,1.27 3.56,21.59 3.56,23.62 9.4,24.38 9.4,19.81 19.05,54.1 19.05,52.58 19.05,51.05 19.05,49.53 19.05,48.01 19.05,55.63 18.29,42.93 1.52,57.15 5.59,46.48 7.11,46.48 1.52,48.26 31.24,56.64 26.16,56.64 18.29,41.66 18.29,40.13 18.29,38.61 18.29,37.08 24.89,64.77 16.26,64.77 33.78,63.5 78.99,13.72 78.99,11.18 68.07,7.62 71.88,7.62 60.71,50.29 55.63,50.29 53.85,5.84 17.27,21.59 33.02,41.91 31.75,45.47 11.43,53.34 11.43,44.45 33.02,36.32 18.29,35.81 42.42,51.56 35.31,29.46 42.16,43.18 37.85,38.1 36.07,24.89 43.94,19.56 46.74,20.07 49.02,17.53 51.31,40.39 64.26,58.42 43.18,34.29 45.72,34.29 48.26,34.29 37.59,9.65 35.81,9.65 46.48,37.59 62.74,23.37
  pour Bottom (rank 6): -2,-2 162,-2 162,102 -2,102
  pour Top (rank 6): -2,-2 162,-2 162,102 -2,102
  pour Route2 (isolate 0.406, rank 6): -2,-2 162,-2 162,102 -2,102
  pour Top: 39.62,34.29 44.45,29.46 49.28,34.29 44.45,39.12
  cutout Top: 54.61,41.66 54.61,29.21 55.88,27.94 57.4,27.94 59.44,25.91 70.61,25.91 72.14,24.38 73.41,24.38 74.93,25.91 78.23,25.91 78.23,42.42 74.93,42.42 73.66,43.69 71.63,43.69 70.36,42.42 58.93,42.42 58.17,41.66
  cutout Bottom: 54.61,41.66 54.61,29.21 55.88,27.94 57.4,27.94 59.44,25.91 70.61,25.91 71.88,24.64 73.66,24.64 74.93,25.91 78.23,25.91 78.23,42.42 74.93,42.42 73.66,43.69 71.63,43.69 70.36,42.42 58.93,42.42 58.17,41.66
GND1  (via drill 0.35, 0.5)
  Top 0.406: OK1.2 50.42,24.77 v50.29,24.89 | 53.59,3.05 55.36,1.28 LED9.C LED8.C LED7.C LED4.C LED3.C | 53.59,3.05 v50.8,3.05 | OK1.4 50.42,22.23 v50.29,22.35 | OK1.6 50.42,19.68 v50.29,19.81 | OK1.8 50.42,17.14 v50.29,17.27 | 53.59,3.05 53.34,3.3 GND/1.TP | v24.89,24.38 25.27,24.77 OK3.2 | U8.3 37.47,21.72 v38.1,21.08 38.73,21.72 U8.2 | v36.58,16 36.2,16.38 U8.5 36.18,17.36 R49.2 | C5.- 11.55,28.83 11.43,28.96
  Top 0.61: EXP0.4 46.83,4.48 46.74,4.57 46.74,5.59 46.83,5.68 EXP0.3
  Top 0.813: 9.65,30.23 9.65,29.8 D2.A | RL1.8 9.65,30.23 | 9.65,30.23 10.92,28.96 11.43,28.96 v13.21,28.96
  Route2 0.813: v13.21,28.96 17.02,25.15 24.64,25.15
  Route15 0.406: v50.8,3.05 47.85,3.05 46.48,4.41 v46.48,5.08
  Bottom 0.406: v50.29,24.89 C8.2 | C35.2 47.59,6.6 46.48,5.49 v46.48,5.08 46.48,3.43 C36.- | C34.2 38.27,20.92 v38.1,21.08
  pour Route2 (no thermals): 24.13,25.4 24.13,17.78 25.4,16.51 29.21,16.51 31.75,13.97 40.64,13.97 45.72,8.89 45.72,4.06 50.29,4.06 50.29,12.95 51.31,13.97 51.31,25.4
  pour Top (no thermals): 46.23,8.64 46.23,6.35 45.72,5.84 45.72,4.32 46.23,3.81 46.23,1.52 47.5,1.52 47.5,8.64
I2C2_SCL  (via drill 0.35)
  Top 0.178: v67,60.73 67,55.58 | 67,55.58 65.02,53.59 | 65.02,53.59 64.26,52.83 64.26,45.72 64.77,45.21 | U3.6 61.85,45.85 v62.99,44.7 | U4.6 62.87,52.7 v62.99,52.58 | v65.02,52.58 65.02,53.59 | U7.26 71.5,52.96 69.6,54.86 67.31,54.86 67,55.17 67,55.58
  Top 0.2: v64.77,44.96 64.77,45.21
  Bottom 0.178: BB1.P9.19 52.83,61.47 53.37,60.94 63.48,60.94 63.75,61.21 64.77,61.21 65.08,60.91 66.83,60.91 v67,60.73 | v62.99,44.7 64.52,44.7 v64.77,44.96 | v62.99,52.58 v65.02,52.58
I2C2_SDA  (via drill 0.35)
  Top 0.178: v64.26,60.48 66.02,60.48 66.6,59.89 66.6,56.69 v66.29,56.39 66.29,55.63 63.75,53.09 63.75,52.07 | 63.75,52.07 63.75,44.45 63.12,43.81 62.15,43.81 U3.5 | U4.5 63.12,51.44 63.75,52.07 | U7.27 71.6,53.62 69.85,55.37 68.33,55.37 v68.07,55.63
  Bottom 0.178: BB1.P9.20 52.83,59.94 53.37,60.48 v64.26,60.48 | v68.07,55.63 67.06,55.63 v66.29,56.39
KSZ_X1
  Top 0.178: U9.20 47.24,36.73 47.24,37.85 45.94,39.15 Q2.3
N$1  (via drill 0.5)
  Top 0.305: U2.5 2.92,55.24 2.54,55.63 | 2.54,57.4 3.05,57.91 v3.56,57.91 4.06,57.4 R11.2
  Top 0.406: 2.54,55.63 2.54,57.4
  pour Bottom (no thermals): 4.57,55.88 3.05,55.88 3.05,58.42 7.11,58.42 7.11,57.4 4.57,57.4
N$2
  Bottom 0.406: R2.1 C2.2
N$3  (via drill 0.5)
  Top 0.61: U1.4 9.78,46.35 v10.41,46.99
  Bottom 0.61: 8.89,48.17 8.89,48.26 10.16,48.26 10.41,48.01 v10.41,46.99
  pour Bottom (no thermals): 8.13,49.53 8.13,47.24 9.14,47.24 9.14,47.75 9.4,48.01 9.4,48.51 9.14,48.77 9.14,49.53
N$4  (via drill 0.35)
  Top 0.178: C30.2 51.66,35.2 v51.31,35.56
  Bottom 0.178: v51.31,35.56 51.31,36.07 51.05,36.32 49.84,36.32 M1.8
N$5  (via drill 0.5)
  Top 0.305: U1.5 2.92,46.35 2.54,46.74 2.54,48.51 3.05,49.02 v3.56,49.02 4.06,48.51 R1.2
  pour Bottom (no thermals): 4.57,46.99 3.05,46.99 3.05,49.53 7.11,49.53 7.11,48.51 4.57,48.51
N$6
  pour Top (no thermals): 16,43.18 8.13,43.18 8.13,41.91 9.91,41.91 13.97,36.58 17.27,36.58 17.27,41.91
N$7
  Top 0.178: R35.1 LED9.A
N$8
  Top 0.406: LED1.C 16.51,3.06 16.51,4.57 17.18,5.25 R401.2
N$9
  Top 0.178: R19.1 LED5.A
N$10  (via drill 0.35)
  Top 0.178: OK1.1 50.42,26.04 v50.29,26.16 | v48.26,21.84 48.26,19.56 47.75,19.05 46.48,19.05 45.97,18.54 v45.97,18.29
  Bottom 0.178: v50.29,26.16 48.77,26.16 48.26,25.65 v48.26,21.84 | R5.1 v45.97,18.29
N$11  (via drill 0.35)
  Top 0.178: OK1.15 58.8,24.77 v59.18,24.38
  Bottom 0.178: v59.18,24.38 59.6,23.96 R9.1
N$12  (via drill 0.35)
  Top 0.178: OK1.7 50.42,18.41 v50.29,18.54
  Bottom 0.178: R8.1 44.45,18.03 45.47,19.05 47.75,19.05 48.26,18.54 v50.29,18.54
N$13  (via drill 0.35)
  Top 0.178: OK1.9 58.8,17.14 v59.18,16.76
  Bottom 0.178: v59.18,16.76 59.6,16.34 R14.2
N$14  (via drill 0.35)
  Top 0.178: OK1.11 58.8,19.68 v59.18,19.3
  Bottom 0.178: v59.18,19.3 59.6,18.88 R12.2
N$15  (via drill 0.35)
  Top 0.178: OK1.13 58.8,22.23 v59.18,21.84
  Bottom 0.178: v59.18,21.84 59.6,21.42 R10.2
N$16
  Top 0.178: R15.1 LED3.A
N$17  (via drill 0.35)
  Top 0.178: OK1.3 50.42,23.5 v50.29,23.62 | v47.5,18.29 47.75,18.54 48.01,18.54 49.02,19.56 v49.02,22.61
  Bottom 0.178: v50.29,23.62 49.53,23.62 49.02,23.11 v49.02,22.61 | R6.1 v47.5,18.29
N$18
  Top 0.178: R16.1 LED4.A
N$19
  pour Top (no thermals): 11.68,52.07 8.13,52.07 8.13,50.8 12.45,50.8 14.22,49.02 17.27,49.02 17.27,54.61 14.22,54.61
N$20
  Top 0.178: R17.1 LED7.A
N$22
  Top 0.178: R21.1 LED8.A
N$23  (via drill 0.35)
  Top 0.178: OK1.5 50.42,20.95 v50.29,21.08
  Bottom 0.178: R7.1 42.93,20.57 43.43,21.08 v50.29,21.08
N$24
  Top 0.178: Q1.1 54.1,47.5 54.86,48.26 56.34,48.26 U3.1
N$25
  Top 0.406: R32.1 R31.1 33.44,69.34 32.51,69.34 31.5,68.33 TH2.2
N$26
  Top 0.178: Q1.2 52.83,45.72 53.59,46.48 53.85,46.48 54.36,46.99 56.34,46.99 U3.2
N$27
  Top 0.178: U8.1 41.41,22.28 R36.1
N$28
  Bottom 0.406: R24.1 C11.2
N$29  (via drill 0.5)
  Top 0.61: U2.4 9.78,55.24 v10.41,55.88
  Bottom 0.61: v10.41,55.88 10.41,56.9 10.16,57.15 8.89,57.15 8.89,57.06
  pour Bottom (no thermals): 8.13,58.42 8.13,56.13 9.14,56.13 9.14,56.64 9.4,56.9 9.4,57.4 9.14,57.66 9.14,58.42
N$30
  Top 0.305: R33.2 R34.1 C19.1
N$31
  Top 0.178: OK2.3 44.45,23.01 44.45,24.13 44.2,24.38 42.16,24.38 42,24.22 R36.2
N$32
  Top 0.305: R11.1 C19.2
N$33
  Top 0.305: C20.2 R1.1
N$34  (via drill 0.35)
  Top 0.2: v62.74,53.85 61.42,53.85 U4.7 | v76.2,53.34 76.2,50.29 76.71,49.78 WP1.TP
  Bottom 0.2: R41.1 60.03,53.85 v62.74,53.85 75.69,53.85 v76.2,53.34
N$35  (via drill 0.35)
  Top 0.178: U4.3 56.69,52.58 v57.91,52.58
  Bottom 0.178: v57.91,52.58 58.17,52.83 R22.1
N$36
  Top 0.305: R3.2 R4.1 11.6,48.51 C20.1
N$38
  Top 0.178: U9.17 48.36,35.73 R55.1
N$40
  Bottom 0.178: M1.16 58.61,29.72 ETH0.1
N$41
  Bottom 0.178: M1.14 59.82,32.38 60.71,31.5 ETH0.2
N$42
  Bottom 0.178: M1.11 59.05,36.2 60.45,34.8 61.21,34.8 63.25,32.77 ETH0.3
N$43
  Bottom 0.178: M1.9 58.8,38.73 59.44,38.1 59.69,38.1 60.71,37.08 ETH0.6
N$44  (via drill 0.35)
  Top 0.178: R23.2 57.49,31.58 v56.9,30.99
  Bottom 0.178: v56.9,30.99 58.36,30.99 M1.15
N$45  (via drill 0.35)
  Top 0.178: R42.2 57.49,36.23 v56.64,37.08
  Bottom 0.178: v56.64,37.08 58.11,37.08 M1.10
N$46
  Top 0.178: R43.2 ETH0.4 61.98,33.53 ETH0.5
N$47
  Top 0.178: ETH0.8 R44.2
  Bottom 0.178: ETH0.7 61.98,38.61 ETH0.8
N$48
  Top 0.178: R23.1 R43.1 R42.1 R44.1 55.79,39.66 C18.1
N$49  (via drill 0.35)
  Top 0.178: v51.31,31.24 51.41,31.14 R51.2 52.93,31.14 53.09,30.99 53.09,28.54 C27.1
  Bottom 0.178: v51.31,31.24 49.84,31.24 M1.2
N$50  (via drill 0.35)
  Top 0.178: R50.1 51.56,37.85 v51.31,37.59 | R50.1 52.58,37.85 53.09,38.35 C25.1 | R48.1 R50.1
  Bottom 0.178: v51.31,37.59 49.84,37.59 M1.7
N$51  (via drill 0.35)
  Top 0.178: v51.31,38.86 51.98,38.86 C29.2
  Bottom 0.178: v51.31,38.86 49.84,38.86 M1.6
N$52  (via drill 0.35)
  Top 0.178: U9.6 43.94,32.72 v43.94,32.77
  Bottom 0.178: v43.94,32.77 44.2,32.51 44.2,29.97 44.03,29.81 R47.2
N$53
  Top 0.178: R52.1 26.25,26.06 OK3.1
N$54  (via drill 0.35)
  Top 0.178: OK3.15 31.62,24.77 v31.24,25.15
  Bottom 0.178: R53.2 30.23,17.36 30.23,24.89 30.48,25.15 v31.24,25.15
N$58  (via drill 0.35)
  Top 0.178: v65.02,51.56 65.13,51.46 66.04,52.38 66.04,52.83 67.46,54.25 U7.1
  Bottom 0.178: R27.1 v65.02,51.56
N$59  (via drill 0.35)
  Top 0.178: v65.02,50.29 66.42,51.69 66.42,52.45 67.59,53.62 U7.2
  Bottom 0.178: R26.1 63.97,50.29 v65.02,50.29
N$76  (via drill 0.35)
  Top 0.178: v65.02,49.02 65.02,49.28 66.8,51.05 66.8,52.32 67.31,52.83 68.58,52.83 U7.3
  Bottom 0.178: R25.1 64.1,49.02 v65.02,49.02
N$94  (via drill 0.35)
  Top 0.178: v65.02,47.75 65.66,48.39 65.66,49.15 67.18,50.67 67.18,51.94 67.56,52.32 U7.4
  Bottom 0.178: R28.1 64.22,47.75 v65.02,47.75
N$95  (via drill 0.35)
  Top 0.178: v65.02,46.23 66.04,47.24 66.04,48.77 67.56,50.29 67.56,51.31 67.92,51.66 U7.5
  Bottom 0.178: R29.1 64.1,46.23 v65.02,46.23
N$96
  Top 0.406: LED2.A 19.07,3.31 R402.1
N$101
  Top 0.406: SJ1.1 83.06,63.44 H4.1
N$102
  Top 0.406: SJ2.1 3.56,65.06 H3.1
N$103
  Top 0.406: SJ3.1 7.22,1.78 H2.1
N$104
  Top 0.406: SJ4.1 82.55,6.55 H1.1
N$112  (via drill 0.35)
  Top 0.178: U7.24 73.51,51.66 v73.41,51.56
  Bottom 0.178: v73.41,51.56 73.41,52.32 73.91,52.83 74.51,52.83 R30.1
N$117
  Top 0.178: R20.1 LED6.A
N$237
  Top 0.406: TH1.2 22.86,68.33 23.88,69.34 25.06,69.34 R13.1 R38.1
N$240
  Top 0.406: R40.1 R18.1 16.42,69.34 15.24,69.34 14.22,68.33 TH0.2
N$300
  Top 0.178: R50.2 53.34,37.85 53.09,37.59 53.09,34.54 | 53.09,34.54 52.83,34.29 51.05,34.29 50.04,33.27 50.04,31.75 49.78,31.5 46.99,31.5 46.48,32 46.38,32 U9.12 | 53.09,34.54 53.75,35.2 C30.1
N$2000
  Top 0.178: U9.11 45.67,32.06 46.74,30.99 50.04,30.99 50.55,31.5 50.55,33.02 51.31,33.78 54.1,33.78 54.86,34.54 54.86,36.22 54.56,36.52 | R48.2 54.56,36.52 | 54.56,36.52 54.86,36.83 54.86,38.86 54.61,39.12 C29.1
N$4200  (via drill 0.35)
  Top 0.178: 46.68,33.07 U9.14 47.24,32.56 v47.24,32.16 | R45.2 51.56,32.51 v51.31,32.26
  Bottom 0.178: v51.31,32.26 49.84,32.26 M1.1 49.4,32.38 48.77,33.02 48.11,33.02 v47.24,32.16
N$4400  (via drill 0.35)
  Top 0.178: U9.15 47.74,32.77 48.01,32.77 48.26,32.51 v48.26,32.16 | R46.1 v51.31,29.72
  Bottom 0.178: v48.26,32.16 48.26,30.48 48.77,29.97 49.59,29.97 M1.3 49.84,29.72 v51.31,29.72
SPI1_CS0
  Top 0.178: BB1.P9.28 40.89,57.66 40.89,39.62 43.18,37.34 43.18,37.33 U9.26
SPI1_INT  (via drill 0.35)
  Top 0.178: v38.61,56.39 38.86,56.13 38.86,34.04 39.46,33.44 R54.1 41.87,32.77 U9.3
  Bottom 0.178: BB1.P9.27 41.4,60.71 41.4,58.93 39.88,57.4 39.88,57.15 39.12,56.39 v38.61,56.39
SPI1_MISO
  Top 0.178: BB1.P9.29 41.4,60.71 41.4,58.93 40.39,57.91 40.39,39.37 43.23,36.52 U9.27
SPI1_MOSI  (via drill 0.35)
  Top 0.178: v39.12,57.4 39.37,57.15 39.37,37.59 40.39,36.58 40.39,36.32 40.89,35.81 41.15,35.81 U9.31
  Bottom 0.178: BB1.P9.30 40.13,58.42 v39.12,57.4
SPI1_SCLK
  Top 0.178: BB1.P9.31 38.86,60.71 38.86,58.93 39.88,57.91 39.88,39.12 42.82,36.17 U9.28
SW_0
  Top 0.178: BB1.P9.25 45.21,61.21 44.17,60.17 44.17,56.49 44.48,56.19 44.48,51.54 44.96,51.05 44.96,49.73 U5.2
SW_0_IN  (via drill 0.35)
  Top 0.178: ISW.3 43.94,60.6 43.71,60.38 43.71,56.49 43.18,55.96 v43.18,52.53 | v46.23,51.31 46.23,49.73 U5.3
  Bottom 0.178: v43.18,52.53 43.64,52.07 45.47,52.07 v46.23,51.31
SW_1
  Top 0.178: BB1.P9.23 46.71,60.94 46.71,58.42 45.72,57.43 45.72,52.83 47.62,50.93 U5.4
SW_1_IN
  Top 0.178: ISW.4 46.48,63.75 47.22,63.02 48.51,63.02 48.79,62.74 48.79,58.19 48.26,57.66 48.26,51.56 48.77,51.05 48.77,49.73 U5.5
SW_2  (via drill 0.35)
  Top 0.178: BB1.P9.15 56.87,60.94 56.87,58.98 56.9,58.95 56.9,56.64 56.64,56.39 54.86,56.39 54.61,56.13 v54.61,51.56 | U5.6 50.16,51.18 v50.29,51.31
  Bottom 0.178: v50.29,51.31 54.36,51.31 v54.61,51.56
SW_2_IN
  Top 0.178: ISW.5 49.02,63.25 49.25,63.02 49.25,58.95 49.53,58.67 49.53,53.34 50.04,52.83 50.8,52.83 51.31,52.32 51.31,49.73 U5.7
SW_3  (via drill 0.35)
  Top 0.178: v51.56,57.91 51.56,54.66 U5.10
  Bottom 0.178: BB1.P9.16 56.64,58.17 51.82,58.17 v51.56,57.91
SW_3_IN
  Top 0.178: ISW.6 51.56,62.99 51.33,62.76 51.33,59.16 52.58,57.91 52.58,54.66 U5.9
SW_4_IN  (via drill 0.35)
  Top 0.178: ISW.7 54.1,57.91 v53.59,57.4 | v50.29,56.9 50.29,54.66 U5.11
  Bottom 0.178: v53.59,57.4 52.07,57.4 51.82,57.15 50.55,57.15 v50.29,56.9
SW_5_IN  (via drill 0.35)
  Top 0.178: ISW.8 56.46,65.1 56.46,58.98 56.39,58.9 56.39,57.4 55.88,56.9 54.86,56.9 54.1,56.13 v53.85,56.13 | U5.14 46.35,56.01 v46.48,56.13
  Bottom 0.178: v46.48,56.13 v53.85,56.13
SW_EXT0
  Top 0.178: BB1.P8.7 64.9,16.89 U6.2
SW_EXT0_IN  (via drill 0.35)
  Top 0.178: U6.3 66.17,20.45 v65.79,20.83
  Bottom 0.178: v65.79,20.83 65.28,21.34 63.33,21.34 R9.2
SW_EXT1
  Top 0.178: BB1.P8.8 69.34,12.45 69.34,13.97 67.56,15.75 67.56,16.51 67.44,16.64 U6.4
SW_EXT1_IN  (via drill 0.35)
  Top 0.178: U6.5 68.71,20.45 v68.33,20.83
  Bottom 0.178: v68.33,20.83 66.8,20.83 66.04,20.07 65.28,20.07 64.52,20.83 R10.1
SW_EXT2  (via drill 0.35)
  Top 0.178: v69.85,16 69.85,17.98 U6.6
  Bottom 0.178: BB1.P8.9 66.8,14.99 68.83,14.99 v69.85,16
SW_EXT2_IN  (via drill 0.35)
  Top 0.178: v70.61,19.81 70.87,19.81 71.12,19.56 71.12,18.24 U6.7
  Bottom 0.178: R12.1 v62.23,18.29 69.09,18.29 v70.61,19.81
SW_EXT3  (via drill 0.35)
  Top 0.178: v69.85,14.99 70.1,15.24 70.87,15.24 71.88,16.26 71.88,21.08 71.37,21.59 71.37,22.91 U6.10
  Bottom 0.178: BB1.P8.10 66.8,12.45 68.58,12.45 69.34,13.21 69.34,14.48 v69.85,14.99
SW_EXT3_IN  (via drill 0.35)
  Top 0.178: U6.9 72.52,20.7 v72.64,20.57
  Bottom 0.178: R14.1 68.58,15.75 72.64,19.81 v72.64,20.57
SW_EXT4  (via drill 0.35)
  Top 0.178: U6.12 68.71,21.72 68.58,21.59 64.52,21.59 64.26,21.34 64.26,12.7 v64.01,12.45
  Bottom 0.178: v64.01,12.45 46.99,12.45 46.23,11.68 45.72,11.68 BB1.P8.26
SW_EXT4_IN  (via drill 0.35)
  Top 0.178: v69.85,24.64 69.85,23.16 U6.11
  Bottom 0.178: v69.85,24.64 69.6,24.89 60.2,24.89 59.69,25.4 58.42,25.4 57.91,24.89 57.91,17.02 57.4,16.51 37.34,16.51 36.83,17.02 32.09,17.02 R53.1
SYS_5V
  pour Route15 (no thermals): 38.1,67.31 38.1,63.5 65.53,63.5 66.8,62.23 66.8,58.42 69.34,58.42 69.34,64.01 66.04,67.31
SYS_RESET  (via drill 0.35)
  Top 0.178: U9.19 48.01,36.78 v48.01,37.08 | v48.01,42.93 48.01,48.01 48.26,48.26 48.26,50.95 46.99,52.22 v46.99,52.83
  Bottom 0.178: BB1.P9.10 65.53,58.42 64.77,57.66 56.39,57.66 53.85,55.12 48.26,55.12 46.99,53.85 v46.99,52.83 | v48.01,37.08 v48.01,42.93
TERM_EXT_0
  Top 0.406: R40.2 C46.1 19.05,65.37 19.05,64.01 19.81,63.25 26.16,63.25 BB1.P9.39
TERM_EXT_1
  Top 0.406: C26.1 R38.2 | C26.1 26.67,66.29 | BB1.P9.40 28.7,60.71 28.7,62.48 27.69,63.5 27.69,65.53 26.84,66.38 C26.1
TERM_EXT_2
  Top 0.406: R32.2 C7.1 32.77,64.1 32.77,63.75 32.26,63.25 31.5,63.25 30.23,61.98 BB1.P9.37
UART4_RXD  (via drill 0.35)
  Top 0.178: OK2.6 44.58,18.16 45.21,18.8 v45.21,25.15 | v58.42,47.75 58.67,48.01 58.67,57.4 58.93,57.66 61.47,57.66 61.72,57.91 61.72,60.96 62.74,61.98 BB1.P9.11
  Bottom 0.178: v58.42,47.75 57.91,47.24 46.48,47.24 45.72,46.48 45.72,43.18 44.96,42.42 40.13,42.42 39.37,41.66 39.37,25.4 40.39,24.38 42.42,24.38 42.58,24.55 R39.2 44.62,24.55 v45.21,25.15
UART5_RXD  (via drill 0.35)
  Top 0.178: EXP0.9 40.83,9.46 v41.22,9.86
  Bottom 0.178: BB1.P8.38 31.01,12.22 40.69,12.22 41.22,11.68 v41.22,9.86
UART5_TXD  (via drill 0.35)
  Top 0.178: v41.4,12.45 41.63,12.22 41.63,10.44 41.91,10.16 41.91,3.81 41.03,2.93
  Top 0.305: 41.03,2.93 EXP0.10
  Bottom 0.178: BB1.P8.37 31.01,12.68 41.17,12.68 v41.4,12.45
VBAT+  (via drill 0.35)
  Top 0.406: v54.61,45.21 55.12,45.72 56.34,45.72 U3.3
  Route15 0.406: v44.45,43.94 54.36,43.94 54.61,44.2 v54.61,45.21
  Bottom 0.406: B1.+2 4.45,26.29 3.05,27.69 3.05,40.64 4.57,42.16 B1.+1 12.95,42.16 15.24,44.45 43.94,44.45 v44.45,43.94
VDD18CORE
  Top 0.178: FB1.1 40.16,29.32
  Top 0.254: U9.5 40.23,29.72 FB1.1 | C23.+ 38.35,27.18 39.12,27.94 39.62,27.94 40.16,28.47 40.16,29.32
VDD18PLL
  Top 0.178: U9.9 44.92,31.41 44.45,31.88 44.45,32.26 44.7,32.51 44.7,33.02 44.45,33.27 44.45,35.31 44.7,35.56 44.7,36.31 U9.23 45.72,37.33 45.72,38.52 C32.1 | 42.11,26.59 C28.+
  Top 0.254: U9.9 45.72,30.55 C33.1
  Top 0.305: FB1.2 42.11,26.59 | C28.+ 44.07,26.54 44.7,27.18 44.7,28.54 C33.1
VDD_ADC  (via drill 0.35)
  Top 0.406: R18.2 v16.51,66.04 | R13.2 v25.15,66.04 | R31.2 v33.53,66.04
  Bottom 0.406: v16.51,66.04 17.78,66.04 19.05,67.31 23.88,67.31 v25.15,66.04 26.42,66.04 27.69,67.31 32.26,67.31 v33.53,66.04 35.56,66.04 36.32,65.28 36.32,60.71 BB1.P9.32
VDD_IN  (via drill 0.35, 0.6)
  Top 0.406: R402.2 R401.1 v17.78,8.38 | v10.41,54.1 10.29,53.98 U2.3 | v10.41,45.21 10.29,45.09 U1.3
  Top 0.61: v2.03,51.56 2.16,51.44 U2.8 | v2.03,41.4 3.17,42.55 U1.8 | 24V.TP 14.4,20.9 FU1.3
  Route15 0.406: v17.78,8.38 10.92,15.24 11,15.32 FU1.4
  Bottom 0.406: 2.03,42.93 1.9,42.93 C4.1
  Bottom 0.61: C14.1 3.81,53.34 v2.03,51.56 | 2.03,42.93 v2.03,41.4
  other vias: 8.13,37.59 6.1,37.59
  pour Route15 (isolate 0.254, rank 4): 8.89,15.24 16.51,15.24 16.51,24.38 10.67,30.23 10.67,55.88 0,55.88 0,41.91 3.81,38.1 3.81,28.45 8.89,23.37
  pour Top (no thermals): 5.33,36.83 8.89,36.83 8.89,38.35 7.87,39.37 7.87,40.39 6.35,40.39 6.35,39.37 5.33,38.35
  pour Bottom: 8.89,14.99 8.89,18.29 10.16,19.56 15.24,19.56 16.51,18.29 16.51,14.99 15.24,13.72 10.16,13.72
VIN  (via drill 0.35)
  Top 0.406: v17.78,4.06 LED1.A
  Top 1.422: FU1.1 FU1.2
  Route15 0.406: v17.78,4.06 15.24,6.6 FU1.1
  pour Route15 (isolate 0.254, rank 3): 4.32,19.3 8.64,19.3 8.64,16.51 16.51,8.64 16.51,4.57 8.89,4.57 8.89,9.14 4.32,13.72

## Text on the board
Top: 1
Route2: 2
Route15: 3
Bottom: 4
tPlace: ArmazCape / Rev B2
Document: ExMachina / Released under / Creatives Commons / CC BY-SA
tDocu: GND | +24V | DV_EN | Top side
bDocu: Bottom side